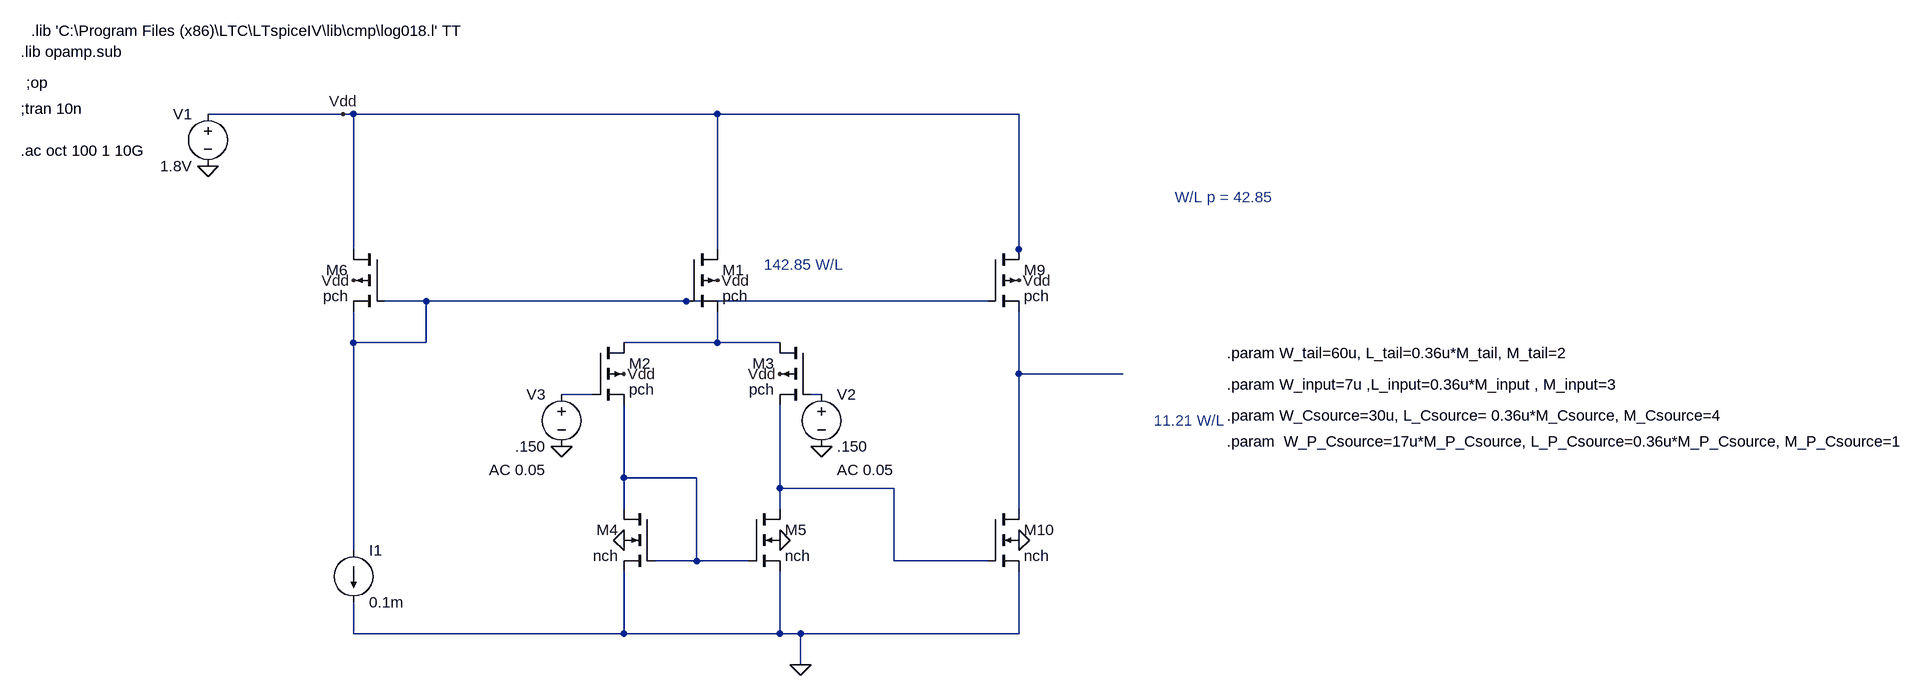
[diagram p0: schematic Gain_Boosting_Op_amp_Stage.asc]
Gain_Boosting_Op_amp_Stage.asc, the LTspice schematic file:
Version 4
SHEET 1 2380 852
WIRE -272 -256 -480 -256
WIRE -256 -256 -272 -256
WIRE 304 -256 -256 -256
WIRE 768 -256 304 -256
WIRE 304 -128 304 -256
WIRE -256 -48 -256 -256
WIRE 304 -48 304 -128
WIRE 768 -48 768 -256
WIRE 768 -32 768 -48
WIRE -144 32 -208 32
WIRE -128 32 -144 32
WIRE 256 32 -128 32
WIRE 560 32 256 32
WIRE 720 32 560 32
WIRE -256 96 -256 48
WIRE -144 96 -144 32
WIRE -144 96 -256 96
WIRE 224 96 160 96
WIRE 304 96 304 48
WIRE 304 96 224 96
WIRE 400 96 304 96
WIRE 768 144 768 48
WIRE 928 144 768 144
WIRE 112 176 64 176
WIRE 464 176 448 176
WIRE 768 272 768 144
WIRE 160 304 160 192
WIRE 240 304 160 304
WIRE 272 304 240 304
WIRE 400 320 400 192
WIRE 576 320 400 320
WIRE 160 352 160 304
WIRE 400 352 400 320
WIRE 768 352 768 272
WIRE -256 416 -256 96
WIRE 272 432 272 304
WIRE 272 432 208 432
WIRE 352 432 272 432
WIRE 576 432 576 320
WIRE 720 432 576 432
WIRE 160 496 160 448
WIRE 400 496 400 448
WIRE -256 544 -256 496
WIRE 160 544 160 496
WIRE 160 544 -256 544
WIRE 400 544 400 496
WIRE 400 544 160 544
WIRE 432 544 400 544
WIRE 768 544 768 448
WIRE 768 544 432 544
WIRE 432 592 432 544
FLAG -480 -176 0
FLAG -272 -256 Vdd
FLAG 432 592 0
FLAG 160 400 0
FLAG 160 144 Vdd
FLAG 400 144 Vdd
FLAG -256 0 Vdd
FLAG 304 0 Vdd
FLAG 768 400 0
FLAG 768 0 Vdd
FLAG 64 256 0
FLAG 464 256 0
FLAG 400 400 0
DATAFLAG 224 96 "round($*1000)/1000"
DATAFLAG 304 -128 "round(-Is(M1)*100000)/100000"
DATAFLAG 160 496 "round(Id(M4)*1000000)/1000000"
DATAFLAG 400 496 "Id(M5)"
DATAFLAG -128 32 ""
DATAFLAG 240 304 "round($*1000)/1000"
DATAFLAG 560 32 ""
DATAFLAG 768 272 "round(Id(M10)*100000)/100000"
SYMBOL Overige\ componenten\\voltage -480 -272 M0
WINDOW 123 0 0 Left 2
WINDOW 39 0 0 Left 2
SYMATTR InstName V1
SYMATTR Value 1.8V
SYMBOL current -256 416 R0
WINDOW 123 0 0 Left 2
WINDOW 39 0 0 Left 2
SYMATTR InstName I1
SYMATTR Value 0.1m
SYMBOL Overige\ componenten\\pmos4 256 -48 R0
SYMATTR InstName M1
SYMATTR Value pch
SYMATTR Value2 l={L_tail} w={W_tail} m={M_tail}
SYMBOL Overige\ componenten\\pmos4 112 96 R0
SYMATTR InstName M2
SYMATTR Value pch
SYMATTR Value2 l={L_input} w={W_input} m={M_input}
SYMBOL Overige\ componenten\\pmos4 448 96 M0
SYMATTR InstName M3
SYMATTR Value pch
SYMATTR Value2 l={L_input} w={W_input} m={M_input}
SYMBOL nmos4 208 352 M0
SYMATTR InstName M4
SYMATTR Value nch
SYMATTR Value2 l={L_Csource} w={W_Csource} m={M_Csource}
SYMBOL Overige\ componenten\\pmos4 -208 -48 M0
SYMATTR InstName M6
SYMATTR Value pch
SYMATTR Value2 l={L_tail} w={W_tail} m={M_tail}
SYMBOL Overige\ componenten\\pmos4 720 -48 R0
SYMATTR InstName M9
SYMATTR Value pch
SYMATTR Value2 l={L_tail} w={W_tail} m={M_tail}
SYMBOL nmos4 720 352 R0
SYMATTR InstName M10
SYMATTR Value nch
SYMATTR Value2 l={L_Csource} w={W_Csource} m={M_Csource}
SYMBOL Overige\ componenten\\voltage 464 160 R0
WINDOW 123 24 132 Left 2
WINDOW 39 0 0 Left 2
SYMATTR Value2 AC 0.05
SYMATTR InstName V2
SYMATTR Value .150
SYMBOL Overige\ componenten\\voltage 64 160 M0
WINDOW 123 24 132 Left 2
WINDOW 39 0 0 Left 2
SYMATTR Value2 AC 0.05
SYMATTR InstName V3
SYMATTR Value .150
SYMBOL nmos4 352 352 R0
SYMATTR InstName M5
SYMATTR Value nch
SYMATTR Value2 l={L_Csource} w={W_Csource} m={M_Csource}
TEXT -752 -384 Left 2 !.lib 'C:\\Program Files (x86)\\LTC\\LTspiceIV\\lib\\cmp\\log018.l' TT
TEXT -768 -352 Left 2 !.lib opamp.sub
TEXT -760 -304 Left 2 !;op
TEXT 1088 112 Left 2 !.param W_tail=60u, L_tail=0.36u*M_tail, M_tail=2
TEXT 1088 160 Left 2 !.param W_input=7u ,L_input=0.36u*M_input , M_input=3
TEXT 1088 208 Left 2 !.param W_Csource=30u, L_Csource= 0.36u*M_Csource, M_Csource=4
TEXT 1008 -128 Left 2 ;W/L p = 42.85
TEXT -768 -264 Left 2 !;tran 10n
TEXT 376 -24 Left 2 ;142.85 W/L
TEXT 976 216 Left 2 ;11.21 W/L
TEXT 1088 248 Left 2 !.param  W_P_Csource=17u*M_P_Csource, L_P_Csource=0.36u*M_P_Csource, M_P_Csource=1
TEXT -768 -200 Left 2 !.ac oct 100 1 10G

The netlist it stands for:
* Gain_Boosting_Op_amp_Stage.asc
V1 Vdd 0 1.8V
I1 N001 0 0.1m
M1 Vdd N001 N002 Vdd pch l={L_tail} w={W_tail} m={M_tail}
M2 N002 N004 N006 Vdd pch l={L_input} w={W_input} m={M_input}
M3 N002 N005 N007 Vdd pch l={L_input} w={W_input} m={M_input}
M4 N006 N006 0 0 nch l={L_Csource} w={W_Csource} m={M_Csource}
M6 Vdd N001 N001 Vdd pch l={L_tail} w={W_tail} m={M_tail}
M9 Vdd N001 N003 Vdd pch l={L_tail} w={W_tail} m={M_tail}
M10 N003 N007 0 0 nch l={L_Csource} w={W_Csource} m={M_Csource}
V2 N005 0 .150 AC 0.05
V3 N004 0 .150 AC 0.05
M5 N007 N006 0 0 nch l={L_Csource} w={W_Csource} m={M_Csource}
.model NMOS NMOS
.model PMOS PMOS
.lib standard.mos
.lib 'C:\Program Files (x86)\LTC\LTspiceIV\lib\cmp\log018.l' TT
.lib opamp.sub
;op
.param W_tail=60u, L_tail=0.36u*M_tail, M_tail=2
.param W_input=7u ,L_input=0.36u*M_input , M_input=3
.param W_Csource=30u, L_Csource= 0.36u*M_Csource, M_Csource=4
* W/L p = 42.85
;tran 10n
* 142.85 W/L
* 11.21 W/L
.param  W_P_Csource=17u*M_P_Csource, L_P_Csource=0.36u*M_P_Csource, M_P_Csource=1
.ac oct 100 1 10G
.backanno
.end